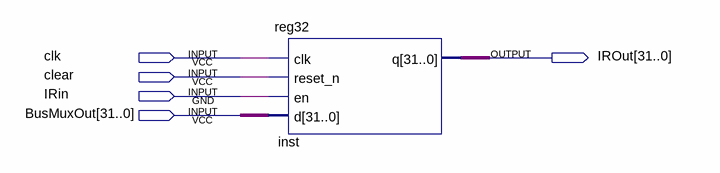
[diagram p0: schematic sheet]
// Quartus schematic ir_design.bdf as structural Verilog: 1 symbols, 5 pins
module ir_design (
  input  clk,
  input  clear,
  input  IRin,
  input  [31:0] BusMuxOut,
  output [31:0] IROut
);

  reg32 inst (.clk(clk), .reset_n(clear), .en(IRin), .d(BusMuxOut), .q(IROut));
endmodule
